# Altium schematic sheet МИЭТ_8161930_003_Э3_Лист_1.SchDoc: МИЭТ_8161930.003.Э3
size A3; Author: Архангельская П.Д.; SheetNumber: 1; SheetTotal: 2
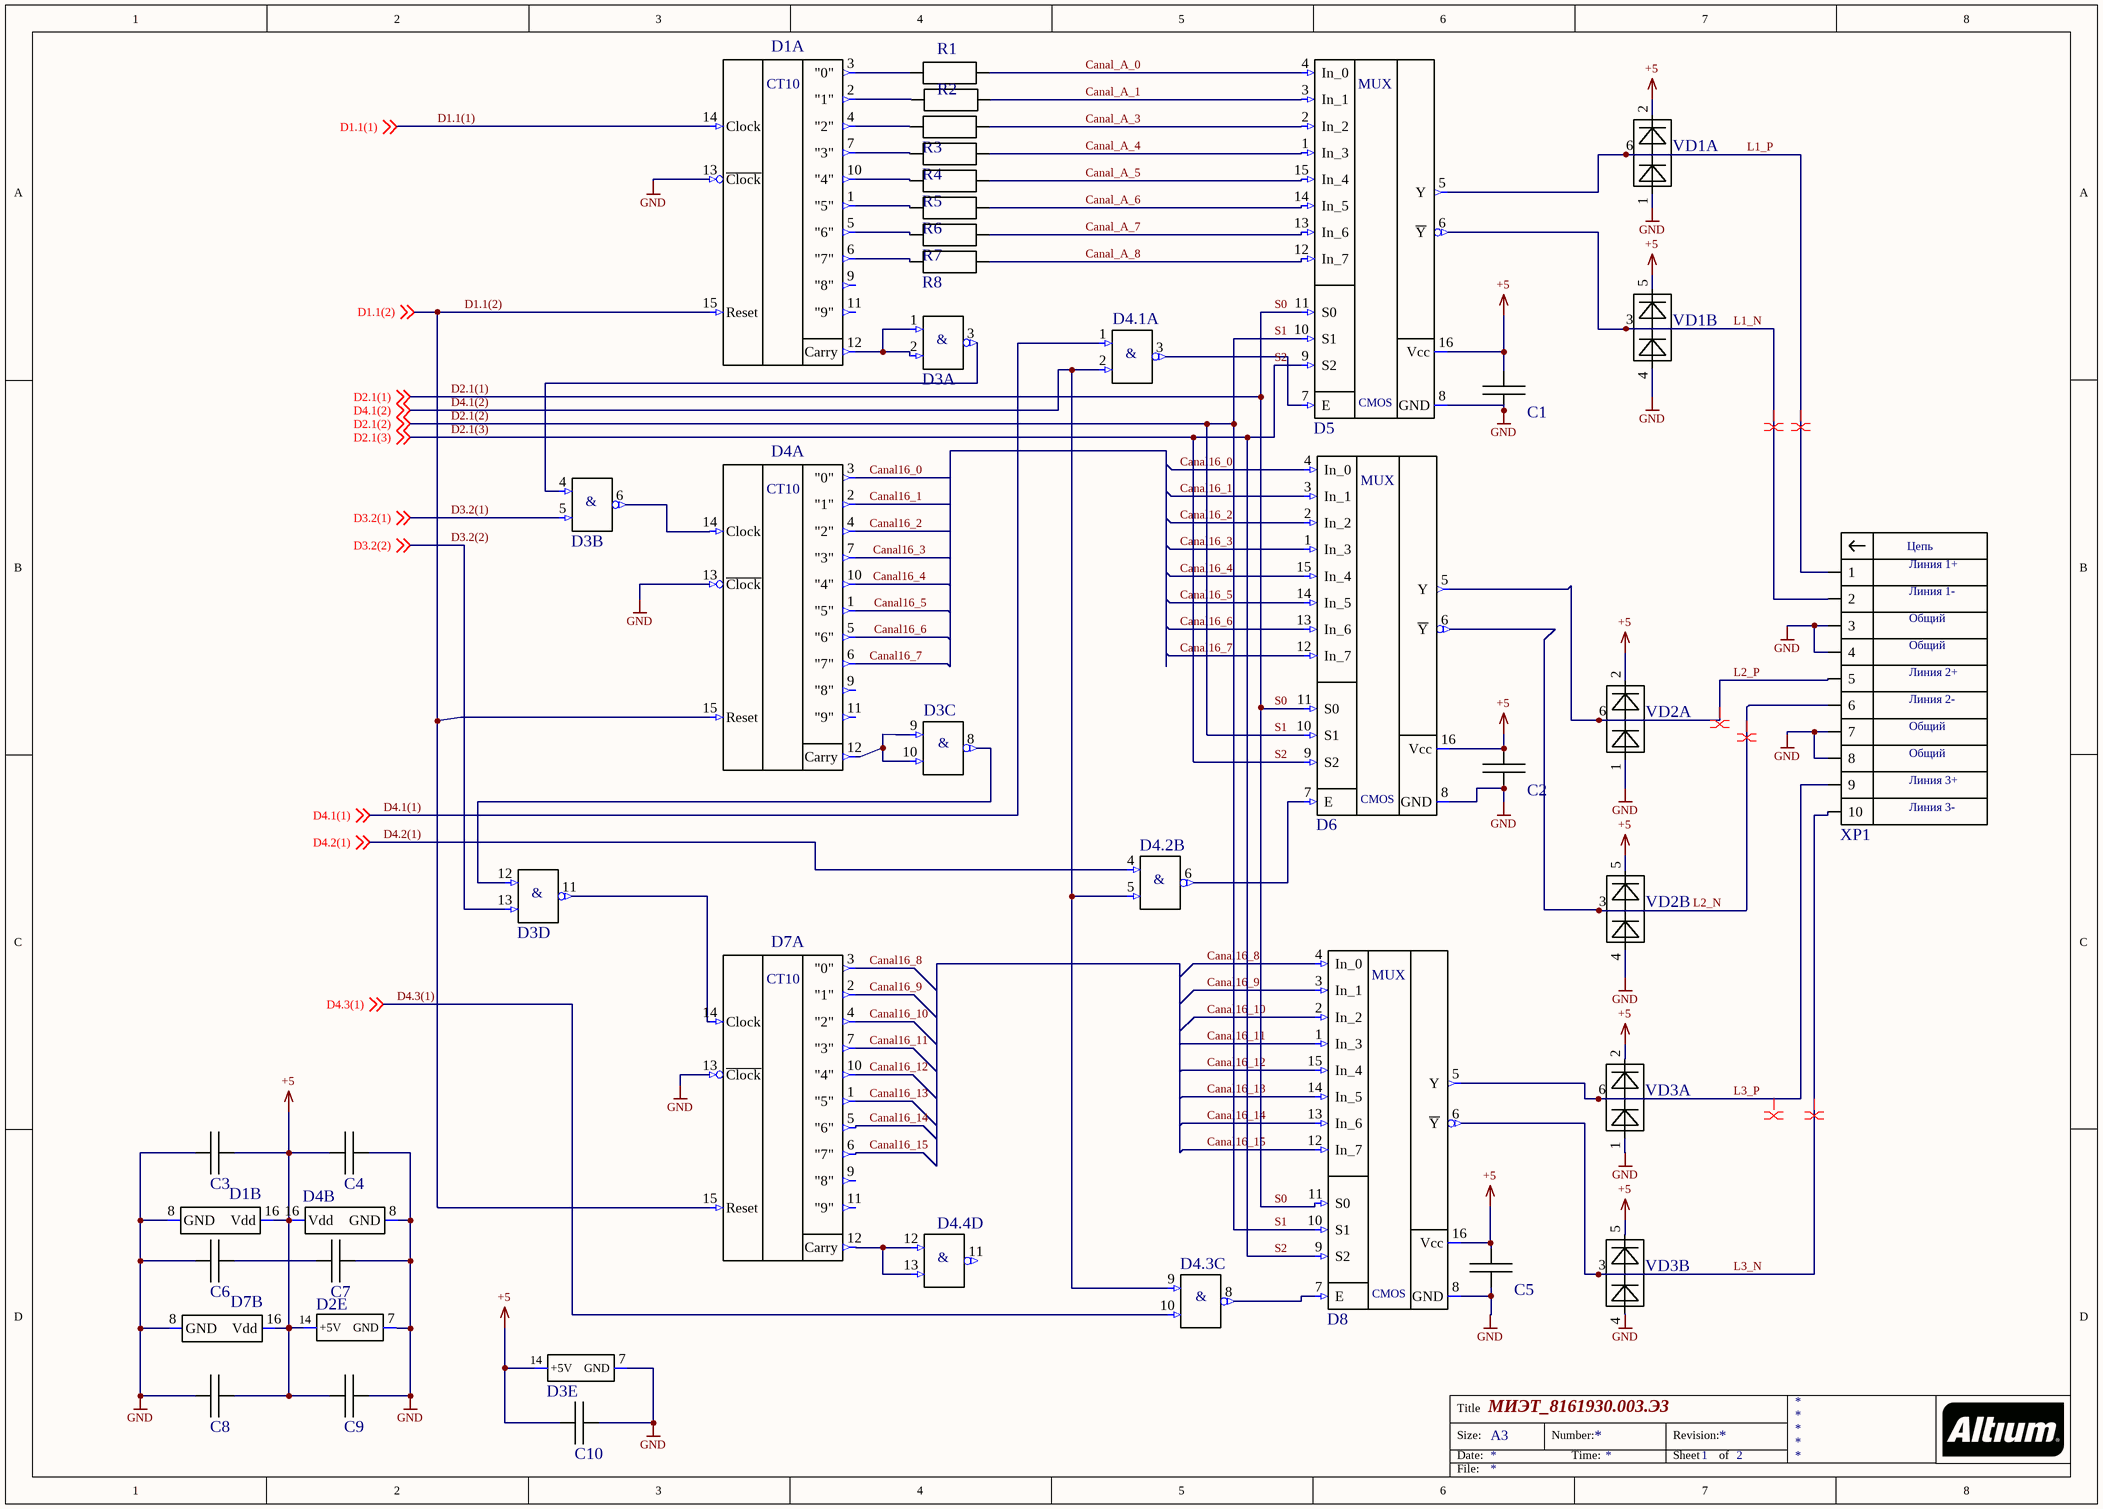
[diagram p0: МИЭТ_8161930_003_Э3_Лист_1.SchDoc]

## Parts
C1  (no value)  [0805_N]
C2  (no value)  [0805_N]
C3  (no value)  [0805_N]
C4  (no value)  [0805_N]
C5  (no value)  [0805_N]
C6  (no value)  [0805_N]
C7  (no value)  [0805_N]
C8  (no value)  [0805_N]
C9  (no value)  [0805_N]
C10  (no value)  [0805_N]
D1  DIP-16  [DIP16]  (value not drawn)  (parts A,B of 2)
D2  74AC00SC  [SO14-N]  (value not drawn)  (part E of 5)
D3  74AC00SC  [SO14-N]  (value not drawn)  (parts A,B,C,D,E of 5)
D4  DIP-16  [DIP16]  (value not drawn)  (parts A,B of 2)
D4.1  74AC00SC  [SO14-N]  (value not drawn)  (part A of 5)
D4.2  74AC00SC  [SO14-N]  (value not drawn)  (part B of 5)
D4.3  74AC00SC  [SO14-N]  (value not drawn)  (part C of 5)
D4.4  74AC00SC  [SO14-N]  (value not drawn)  (part D of 5)
D5  SOIC-16  [SO16-N]  (value not drawn)
D6  SOIC-16  [SO16-N]  (value not drawn)
D7  DIP-16  [DIP16]  (value not drawn)  (parts A,B of 2)
D8  SOIC-16  [SO16-N]  (value not drawn)
R1  0805  [RES_0805_2012_N]  (value not drawn)
R2  0805  [RES_0805_2012_N]  (value not drawn)
R3  0805  [RES_0805_2012_N]  (value not drawn)
R4  0805  [RES_0805_2012_N]  (value not drawn)
R5  0805  [RES_0805_2012_N]  (value not drawn)
R6  0805  [RES_0805_2012_N]  (value not drawn)
R7  0805  [RES_0805_2012_N]  (value not drawn)
R8  0805  [RES_0805_2012_N]  (value not drawn)
VD1  SOT-363  [SOT363_NXP]  (value not drawn)  (parts A,B of 2)
VD2  SOT-363  [SOT363_NXP]  (value not drawn)  (parts A,B of 2)
VD3  SOT-363  [SOT363_NXP]  (value not drawn)  (parts A,B of 2)
XP1  TE_1-1634689-0  [BH-10R]  (value not drawn)

## Nets
+5: C1.2 C2.2 C3.2 C4.1 C5.2 C8.2 C9.1 C10.1 D1.16(Vdd) D2.14(+5V) D3.14(+5V) D4.16(Vdd) D5.16(Vcc) D6.16(Vcc) D7.16(Vdd) D8.16(Vcc) VD1.2(K2) VD1.5(K4) VD2.2(K2) VD2.5(K4) VD3.2(K2) VD3.5(K4)
GND: C1.1 C2.1 C3.1 C4.2 C5.1 C6.1 C7.2 C8.1 C9.2 C10.2 D1.8(GND) D1.13(~{Clock}) D2.7(GND) D3.7(GND) D4.8(GND) D4.13(~{Clock}) D5.8(GND) D6.8(GND) D7.8(GND) D7.13(~{Clock}) D8.8(GND) VD1.1(A1) VD1.4(A3) VD2.1(A1) VD2.4(A3) VD3.1(A1) VD3.4(A3) XP1.3 XP1.4 XP1.7 XP1.8
Canal16_0: D4.3("0") D6.4(In_0)
Canal16_1: D4.2("1") D6.3(In_1)
Canal16_2: D4.4("2") D6.2(In_2)
Canal16_3: D4.7("3") D6.1(In_3)
Canal16_4: D4.10("4") D6.15(In_4)
Canal16_5: D4.1("5") D6.14(In_5)
Canal16_6: D4.5("6") D6.13(In_6)
Canal16_7: D4.6("7") D6.12(In_7)
Canal16_8: D7.3("0") D8.4(In_0)
Canal16_9: D7.2("1") D8.3(In_1)
Canal16_10: D7.4("2") D8.2(In_2)
Canal16_11: D7.7("3") D8.1(In_3)
Canal16_12: D7.10("4") D8.15(In_4)
Canal16_13: D7.1("5") D8.14(In_5)
Canal16_14: D7.5("6") D8.13(In_6)
Canal16_15: D7.6("7") D8.12(In_7)
D1.1(1): D1.14(Clock) ; off-sheet D1.1(1)
D1.1(2): D1.15(Reset) D4.15(Reset) D7.15(Reset) ; off-sheet D1.1(2)
D2.1(1): D5.11(S0) D6.11(S0) D8.11(S0) ; off-sheet D2.1(1)  [also labelled S0]
D2.1(2): D5.10(S1) D6.10(S1) D8.10(S1) ; off-sheet D2.1(2)  [also labelled S1]
D2.1(3): D5.9(S2) D6.9(S2) D8.9(S2) ; off-sheet D2.1(3)  [also labelled S2]
D3.2(1): D3.5(In2) ; off-sheet D3.2(1)
D3.2(2): D3.13(In2) ; off-sheet D3.2(2)
D4.1(1): D4.1.1(In1) ; off-sheet D4.1(1)
D4.1(2): D4.1.2(In2) D4.2.5(In2) D4.3.9(In1) ; off-sheet D4.1(2)
D4.2(1): D4.2.4(In1) ; off-sheet D4.2(1)
D4.3(1): D4.3.10(In2) ; off-sheet D4.3(1)
L1_N: D5.6(~{Y}) VD1.3(K3A4) XP1.2
L1_P: D5.5(Y) VD1.6(K1A2) XP1.1
L2_N: D6.6(~{Y}) VD2.3(K3A4) XP1.6
L2_P: D6.5(Y) VD2.6(K1A2) XP1.5
L3_N: D8.6(~{Y}) VD3.3(K3A4) XP1.10
L3_P: D8.5(Y) VD3.6(K1A2) XP1.9
Сanal_A_0: D5.4(In_0) R1.2
Сanal_A_1: D5.3(In_1) R2.2
Сanal_A_3: D5.2(In_2) R3.2
Сanal_A_4: D5.1(In_3) R4.2
Сanal_A_5: D5.15(In_4) R5.2
Сanal_A_6: D5.14(In_5) R6.2
Сanal_A_7: D5.13(In_6) R7.2
Сanal_A_8: D5.12(In_7) R8.2
NetC6_2: C6.2 C7.1
NetD1_1: D1.1("5") R6.1
NetD1_2: D1.2("1") R2.1
NetD1_3: D1.3("0") R1.1
NetD1_4: D1.4("2") R3.1
NetD1_5: D1.5("6") R7.1
NetD1_6: D1.6("7") R8.1
NetD1_7: D1.7("3") R4.1
NetD1_10: D1.10("4") R5.1
NetD1_12: D1.12(Carry) D3.1(In1) D3.2(In2)
NetD3_3: D3.3(Out) D3.4(In1)
NetD3_6: D3.6(Out) D4.14(Clock)
NetD3_8: D3.8(Out) D3.12(In1)
NetD3_9: D3.9(In1) D3.10(In2) D4.12(Carry)
NetD3_11: D3.11(Out) D7.14(Clock)
NetD4.1_3: D4.1.3(Out) D5.7(E)
NetD4.2_6: D4.2.6(Out) D6.7(E)
NetD4.3_8: D4.3.8(Out) D8.7(E)
NetD4.4_12: D4.4.12(In1) D4.4.13(In2) D7.12(Carry)

Not connected (* = marked no-connect by the designer): D1 9("8") 11("9"); D4 9("8") 11("9"); D4.4 11(Out); D7 9("8") 11("9")

## Layout directives
differential pair: L1_N, L1_P, L2_N, L2_P, L3_N, L3_P

## Notes on the sheet
- Линия 1+
- Линия 1-
- Общий
- Линия 2+
- Линия 2-
- Линия 3+
- Линия 3-
- Title
- Size:
- Date:
- A3
- Number:
- Time:
- Revision:
- Sheet
- of
- File:
- (in symbol 74AC00SC, part A) &
- (in symbol 74AC00SC, part B) &
- (in symbol 74AC00SC, part C) &
- (in symbol 74AC00SC, part D) &
- (in symbol 74HC151D) MUX; CMOS
- (in symbol HCF4017BEY, part A) CT10
- (in symbol TE_1-1634689-0) Цепь

## Library data of the parts
C1-C10 = К10-79_0805_Н90: Чип конденсатор 0805 Н90 ряд Е6; Manufacturer: ООО "Кулон"; Name: Конденсатор К10-79; Tolerance: +80%-20%; TU: АЖЯР.673511.004 ТУ; Type: K10-79; BOM: Конденсатор К10-79-*-B-*+80%-20%-Н90 АЖЯР.673511.004 ТУ; Created_by: Желобаев; Version: 0; Weight: 0.05; Voltage: *; TKE: Н90; Value: *; Value_KD: *; Case: 0805; Issue_date: 19_12_2018
D1 D4 D7 = HCF4017BEY: Декадный счетчик c 10 декодированными выходами; Manufacturer: STMicroelectronics; Power_Voltage: -0.5 -22 V; BOM: Микросхема HCF4017BEY "STMicroelectronics"; Created_by: Желобаев; Name: Микросхема HCF4017BEY; Case: DIP-16; Issue_date: 05.04.2019; Version: 0
D2 D3 D4.1-D4.4 = 74AC00SC: 4 элемента 2И-НЕ TTL SOIC-14; Manufacturer: ON Semiconductor; BOM: Микросхема 74AC00SC "ON Semiconductor"; Created_by: Желобаев; Power_Voltage: 4.5 - 5.5 V; Name: Микросхема 74AC00SC; Issue_date: 10.04.2019; Case: SOIC-14; Version: 0
D5 D6 D8 = 74HC151D: мультиплексор 8 канальный CMOS; Manufacturer: NXP Semiconductors; Power_Voltage: 2.0 -6.0 V; BOM: Микросхема 74YC151D "NXP Semiconductors"; Created_by: Желобаев; Name: Микросхема 74YC151D; Case: SOIC-16; Issue_date: 05.04.2019; Version: 0
R1-R8 = Р1-12-0,125-5%: Резистор от 0,75 Ом до 2 МОм; Manufacturer: ОАО "НПО "Эркон"; Reliability: 0,000001; LiveStatus: Производится; Tolerance: 5%; Created_by: Желобаев; TU: АЛЯР.434110.005 ТУ; Hight: 0,5; Voltage: 150; TKR: M; Name: Резистор Р1-12-0,125; BOM: Резистор Р1-12-0,125 * 5%-M-"A" АЛЯР.434110.005 ТУ; Issue_Date: 05_12_2018; Version: 00; ComponentLink1URL: https://www.erkon-nn.ru/catalog/rezistory-obshchego-primeneniya/; ComponentLink1Description: Сайт производителя; Type: Р1-12-0,125±5%-М-"А"; Weight: 0,01; Size: 0805; Value_KD: *
VD1-VD3 = BAV99S: Высокоскоростные, переключающие диоды; Manufacturer: Nexperia; BOM: Диод BAV99S "Nexperia"; Voltage: 100; Name: Диод BAV99S; Created_by: Желобаев; Version: 0; Case: SOT-363; Issue_date: 07.01.2019
XP1 = TE_1-1634689-0: Вилка типа BH-10R угловая правая двухрядная 2х5х2.54; Manufacturer: TE Connectivity; Created_by: Желобаев; BOM: Вилка угловая TE_1-1634689-0 "TE Connectivity"; Name: Вилка угловая TE_1-1634689-0; Issue_date: 13.05.2019; Version: 0; Case: BH-10R